# Altium schematic sheet BTB_Connector_H.schdoc
size 420 x 298 mm; Symbol: Sheet-Symbol_A4; Company: 嘉立创EDA; Version: V1.0; Page Size: A4; @Project Name: prj_extend_and_core_board; @Page Count: 7; @Update Date: 2024-07-08; @Create Date: 2024-05-07; @Schematic Name: Schematic1; @Page No: 4; @Page Name: BTB_Connector_H; Device: Sheet-Symbol_A4
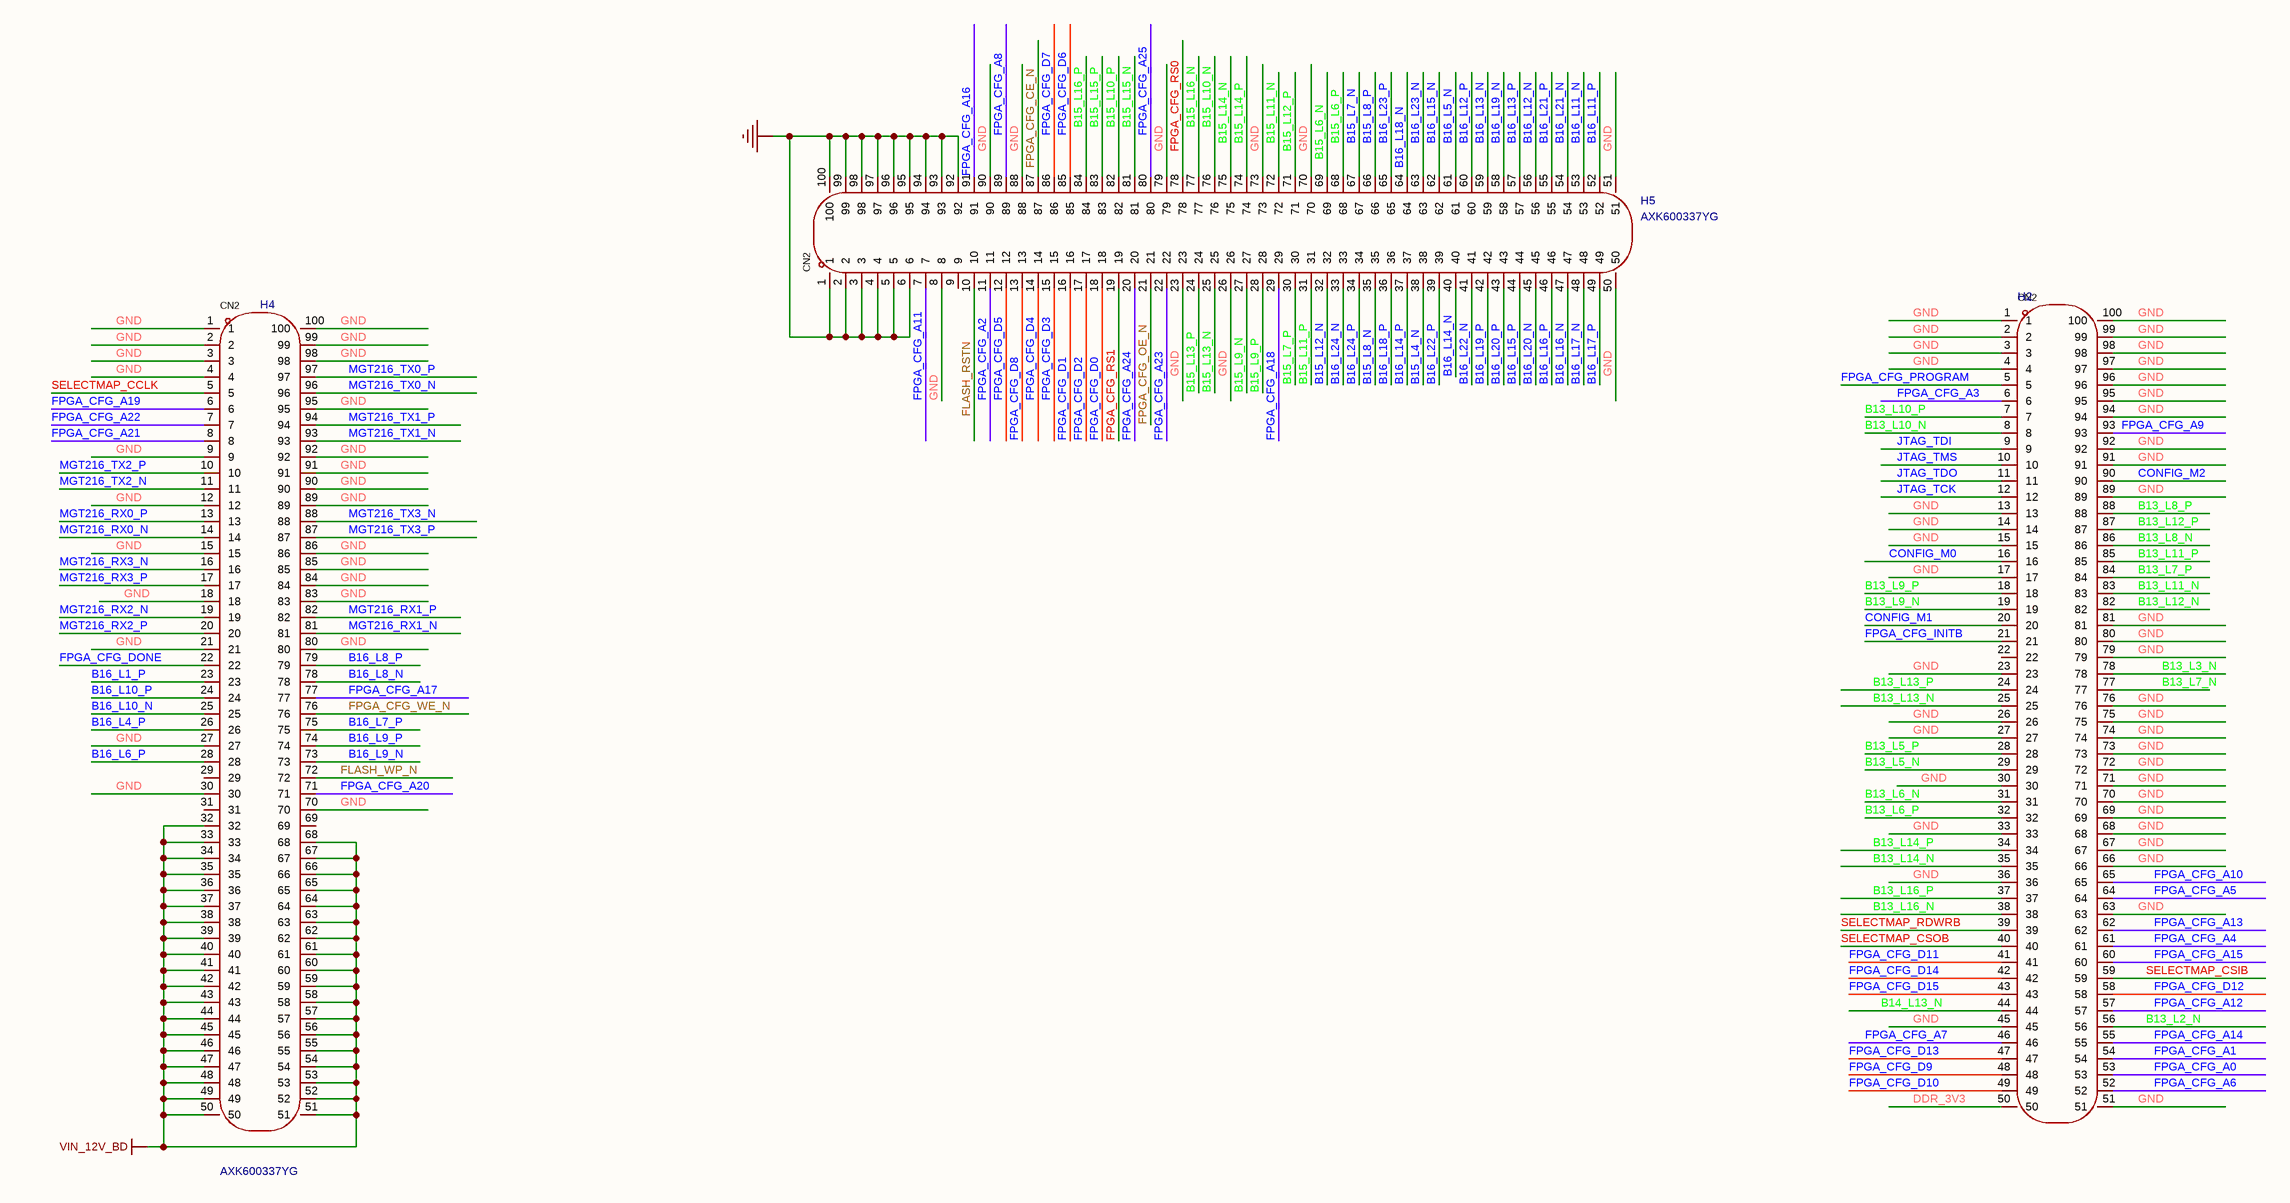
[diagram p0: BTB_Connector_H.schdoc]

## Parts
H2  (no value)  [AXK600337YG]
H4  (no value)  [AXK600337YG]
H5  (no value)  [AXK600337YG]

## Nets
GND: H2.1 H2.2 H2.3 H2.4 H2.13 H2.14 H2.15 H2.17 H2.23 H2.26 H2.27 H2.30 H2.33 H2.36 H2.45 H2.51 H2.63 H2.66 H2.67 H2.68 H2.69 H2.70 H2.71 H2.72 H2.73 H2.74 H2.75 H2.76 H2.79 H2.80 H2.81 H2.89 H2.91 H2.92 H2.94 H2.95 H2.96 H2.97 H2.98 H2.99 H2.100 H4.1 H4.2 H4.3 H4.4 H4.9 H4.12 H4.15 H4.18 H4.21 H4.27 H4.30 H4.70 H4.80 H4.83 H4.84 H4.85 H4.86 H4.89 H4.90 H4.91 H4.92 H4.95 H4.98 H4.99 H4.100 H5.1 H5.2 H5.3 H5.4 H5.5 H5.6 H5.8 H5.23 H5.26 H5.50 H5.51 H5.70 H5.73 H5.79 H5.88 H5.90 H5.92 H5.93 H5.94 H5.95 H5.96 H5.97 H5.98 H5.99 H5.100
VIN_12V_BD: H4.32 H4.33 H4.34 H4.35 H4.36 H4.37 H4.38 H4.39 H4.40 H4.41 H4.42 H4.43 H4.44 H4.45 H4.46 H4.47 H4.48 H4.49 H4.50 H4.51 H4.52 H4.53 H4.54 H4.55 H4.56 H4.57 H4.58 H4.59 H4.60 H4.61 H4.62 H4.63 H4.64 H4.65 H4.66 H4.67 H4.68
B13_L2_N: H2.56
B13_L3_N: H2.78
B13_L5_N: H2.29
B13_L5_P: H2.28
B13_L6_N: H2.31
B13_L6_P: H2.32
B13_L7_N: H2.77
B13_L7_P: H2.84
B13_L8_N: H2.86
B13_L8_P: H2.88
B13_L9_N: H2.19
B13_L9_P: H2.18
B13_L10_N: H2.8
B13_L10_P: H2.7
B13_L11_N: H2.83
B13_L11_P: H2.85
B13_L12_N: H2.82
B13_L12_P: H2.87
B13_L13_N: H2.25
B13_L13_P: H2.24
B13_L14_N: H2.35
B13_L14_P: H2.34
B13_L16_N: H2.38
B13_L16_P: H2.37
B14_L13_N: H2.44
B15_L4_N: H5.38
B15_L6_N: H5.69
B15_L6_P: H5.68
B15_L7_N: H5.67
B15_L7_P: H5.30
B15_L8_N: H5.35
B15_L8_P: H5.66
B15_L9_N: H5.27
B15_L9_P: H5.28
B15_L10_N: H5.76
B15_L10_P: H5.82
B15_L11_N: H5.72
B15_L11_P: H5.31
B15_L12_N: H5.32
B15_L12_P: H5.71
B15_L13_N: H5.25
B15_L13_P: H5.24
B15_L14_N: H5.75
B15_L14_P: H5.74
B15_L15_N: H5.81
B15_L15_P: H5.83
B15_L16_N: H5.77
B15_L16_P: H5.84
B16_L1_P: H4.23
B16_L4_P: H4.26
B16_L5_N: H5.61
B16_L6_P: H4.28
B16_L7_P: H4.75
B16_L8_N: H4.78
B16_L8_P: H4.79
B16_L9_N: H4.73
B16_L9_P: H4.74
B16_L10_N: H4.25
B16_L10_P: H4.24
B16_L11_N: H5.53
B16_L11_P: H5.52
B16_L12_N: H5.56
B16_L12_P: H5.60
B16_L13_N: H5.59
B16_L13_P: H5.57
B16_L14_N: H5.40
B16_L14_P: H5.37
B16_L15_N: H5.62
B16_L15_P: H5.44
B16_L16_N: H5.47
B16_L16_P: H5.46
B16_L17_N: H5.48
B16_L17_P: H5.49
B16_L18_N: H5.64
B16_L18_P: H5.36
B16_L19_N: H5.58
B16_L19_P: H5.42
B16_L20_N: H5.45
B16_L20_P: H5.43
B16_L21_N: H5.54
B16_L21_P: H5.55
B16_L22_N: H5.41
B16_L22_P: H5.39
B16_L23_N: H5.63
B16_L23_P: H5.65
B16_L24_N: H5.33
B16_L24_P: H5.34
CONFIG_M0: H2.16
CONFIG_M1: H2.20
CONFIG_M2: H2.90
DDR_3V3: H2.50
FLASH_RSTN: H5.10
FLASH_WP_N: H4.72
FPGA_CFG_A0: H2.53
FPGA_CFG_A1: H2.54
FPGA_CFG_A2: H5.11
FPGA_CFG_A3: H2.6
FPGA_CFG_A4: H2.61
FPGA_CFG_A5: H2.64
FPGA_CFG_A6: H2.52
FPGA_CFG_A7: H2.46
FPGA_CFG_A8: H5.89
FPGA_CFG_A9: H2.93
FPGA_CFG_A10: H2.65
FPGA_CFG_A11: H5.7
FPGA_CFG_A12: H2.57
FPGA_CFG_A13: H2.62
FPGA_CFG_A14: H2.55
FPGA_CFG_A15: H2.60
FPGA_CFG_A16: H5.91
FPGA_CFG_A17: H4.77
FPGA_CFG_A18: H5.29
FPGA_CFG_A19: H4.6
FPGA_CFG_A20: H4.71
FPGA_CFG_A21: H4.8
FPGA_CFG_A22: H4.7
FPGA_CFG_A23: H5.22
FPGA_CFG_A24: H5.20
FPGA_CFG_A25: H5.80
FPGA_CFG_CE_N: H5.87
FPGA_CFG_D0: H5.18
FPGA_CFG_D1: H5.16
FPGA_CFG_D2: H5.17
FPGA_CFG_D3: H5.15
FPGA_CFG_D4: H5.14
FPGA_CFG_D5: H5.12
FPGA_CFG_D6: H5.85
FPGA_CFG_D7: H5.86
FPGA_CFG_D8: H5.13
FPGA_CFG_D9: H2.48
FPGA_CFG_D10: H2.49
FPGA_CFG_D11: H2.41
FPGA_CFG_D12: H2.58
FPGA_CFG_D13: H2.47
FPGA_CFG_D14: H2.42
FPGA_CFG_D15: H2.43
FPGA_CFG_DONE: H4.22
FPGA_CFG_INITB: H2.21
FPGA_CFG_OE_N: H5.21
FPGA_CFG_PROGRAM: H2.5
FPGA_CFG_RS0: H5.78
FPGA_CFG_RS1: H5.19
FPGA_CFG_WE_N: H4.76
JTAG_TCK: H2.12
JTAG_TDI: H2.9
JTAG_TDO: H2.11
JTAG_TMS: H2.10
MGT216_RX0_N: H4.14
MGT216_RX0_P: H4.13
MGT216_RX1_N: H4.81
MGT216_RX1_P: H4.82
MGT216_RX2_N: H4.19
MGT216_RX2_P: H4.20
MGT216_RX3_N: H4.16
MGT216_RX3_P: H4.17
MGT216_TX0_N: H4.96
MGT216_TX0_P: H4.97
MGT216_TX1_N: H4.93
MGT216_TX1_P: H4.94
MGT216_TX2_N: H4.11
MGT216_TX2_P: H4.10
MGT216_TX3_N: H4.88
MGT216_TX3_P: H4.87
SELECTMAP_CCLK: H4.5
SELECTMAP_CSIB: H2.59
SELECTMAP_CSOB: H2.40
SELECTMAP_RDWRB: H2.39

Not connected (* = marked no-connect by the designer): H2 22; H4 29 31 69; H5 9

## Notes on the sheet
- 1
- 2
- 3
- 4
- 5
- 6
- A
- B
- C
- 更新日期
- 2024-07-08
- D
- 原理图
- 图页
- Schematic1
- BTB_Connector_H
- 创建日期
- 物料编码
- 2024-05-07
- 审阅
- 绘制
- prj_extend_and_core_board
- 版本
- V1.0
- 尺寸
- A4
- 页
- 嘉立创EDA
- 共
- 7
- (in symbol AXK600337YG) CN2

## Library data of the parts
H2 H4 H5 = AXK600337YG: Check: false; AddInBom: yes; Device: AXK600337YG; SymbolName: AXK600337YG; ConvertToPcb: yes